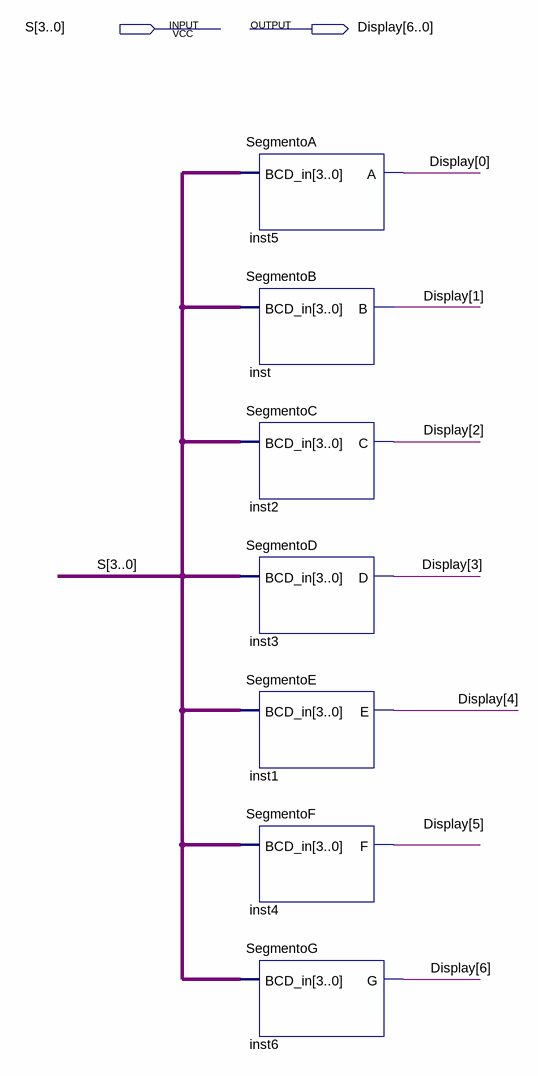
[diagram p0: schematic sheet]
// Quartus schematic Display.bdf as structural Verilog: 7 symbols, 2 pins
module Display (
  input  [3:0] S,
  output [6:0] Display
);

  SegmentoA inst5 (.BCD_in(S), .A(Display[0]));
  SegmentoB inst (.BCD_in(S), .B(Display[1]));
  SegmentoC inst2 (.BCD_in(S), .C(Display[2]));
  SegmentoD inst3 (.BCD_in(S), .D(Display[3]));
  SegmentoE inst1 (.BCD_in(S), .E(Display[4]));
  SegmentoF inst4 (.BCD_in(S), .F(Display[5]));
  SegmentoG inst6 (.BCD_in(S), .G(Display[6]));
endmodule
